# EAGLE design master-board plus slave (EAGLE 9.2.0)
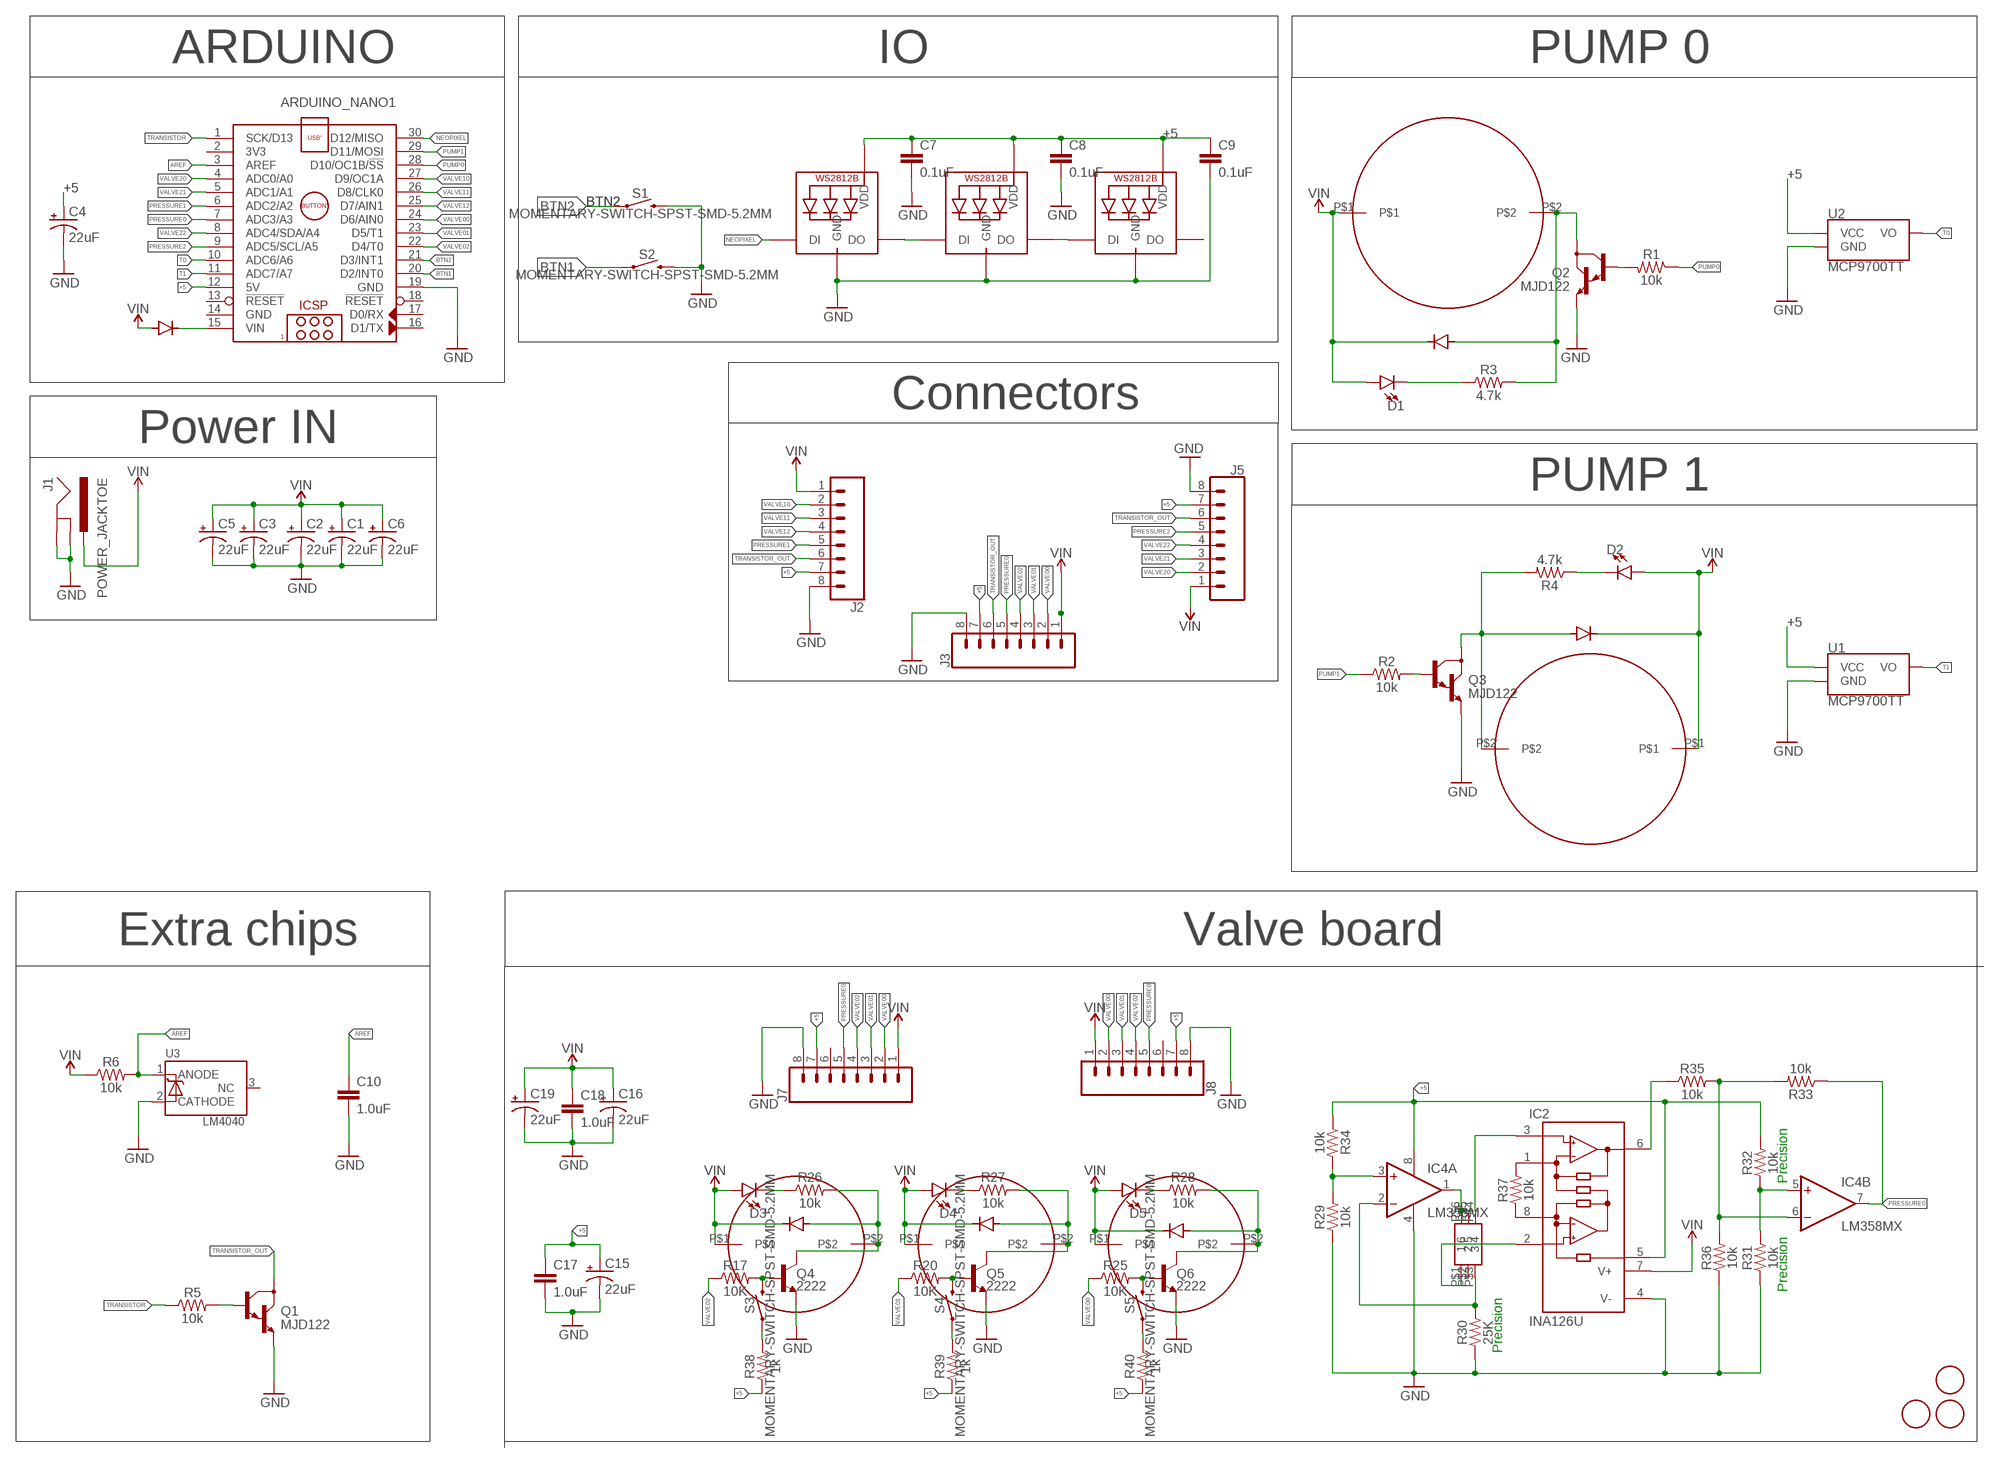
[diagram p0: schematic, sheet 1]

## Parts
ARDUINO_NANO1  ARDUINO_NANO  [ARDUINO_NANO]
C1  22uF  22UF-POLAR-PANASONIC_C-35V-20%  [PANASONIC_C]
C2  22uF  22UF-POLAR-PANASONIC_C-35V-20%  [PANASONIC_C]
C3  22uF  22UF-POLAR-PANASONIC_C-35V-20%  [PANASONIC_C]
C4  22uF  22UF-POLAR-PANASONIC_C-35V-20%  [PANASONIC_C]
C5  22uF  22UF-POLAR-PANASONIC_C-35V-20%  [PANASONIC_C]
C6  22uF  22UF-POLAR-PANASONIC_C-35V-20%  [PANASONIC_C]
C7  0.1uF  0.1UF-0603-25V-(+80/-20%)  [0603]
C8  0.1uF  0.1UF-0603-25V-(+80/-20%)  [0603]
C9  0.1uF  0.1UF-0603-25V-(+80/-20%)  [0603]
C10  1.0uF  1.0UF-0603-16V-10%  [0603]
C15  22uF  22UF-POLAR-PANASONIC_C-35V-20%  [PANASONIC_C]
C16  22uF  22UF-POLAR-PANASONIC_C-35V-20%  [PANASONIC_C]
C17  1.0uF  1.0UF-0603-16V-10%  [0603]
C18  1.0uF  1.0UF-0603-16V-10%  [0603]
C19  22uF  22UF-POLAR-PANASONIC_C-35V-20%  [PANASONIC_C]
D1  LED0603  [LED-0603]
D2  LED0603  [LED-0603]
D3  LED0603  [LED-0603]
D4  LED0603  [LED-0603]
D5  LED0603  [LED-0603]
IC2  INA126U  [SO08]
IC4  LM358MX  [SO08]
J1  POWER_JACKTOE  [POWER_JACK_SMD_OVERPASTE_TOE]
J2  CONN_08FLIPPED  [1X08]
J3  CONN_08"  [1X08]
J5  CONN_081X08_FEMALE_FLIPPED  [1X08_FEMALE_FLIPPED]
J7  CONN_08  [1X08_MALE_FLIPPED]
J8  CONN_08NO_SILK_FEMALE_PTH  [1X08_NO_SILK]
LED1  WS2812B5050  [WS2812B]
LED2  WS2812B5050  [WS2812B]
LED3  WS2812B5050  [WS2812B]
Q1  MJD122  [DPAK]
Q2  MJD122  [DPAK]
Q3  MJD122  [DPAK]
Q4  2222  TRANS_NPN-MMBT2222AL  [SOT23-3]
Q5  2222  TRANS_NPN-MMBT2222AL  [SOT23-3]
Q6  2222  TRANS_NPN-MMBT2222AL  [SOT23-3]
R1  10k  10KOHM-0603-1/10W-1%  [0603]
R2  10k  10KOHM-0603-1/10W-1%  [0603]
R3  4.7k  4.7KOHM-0603-1/10W-1%  [0603]
R4  4.7k  4.7KOHM-0603-1/10W-1%  [0603]
R5  10k  10KOHM-0603-1/10W-1%  [0603]
R6  10k  10KOHM-0603-1/10W-1%  [0603]
R17  10K  1KOHM-0603-1/10W-1%  [0603]
R20  10K  1KOHM-0603-1/10W-1%  [0603]
R25  10K  1KOHM-0603-1/10W-1%  [0603]
R26  10k  10KOHM-0603-1/10W-1%  [0603]
R27  10k  10KOHM-0603-1/10W-1%  [0603]
R28  10k  10KOHM-0603-1/10W-1%  [0603]
R29  10k  10KOHM-0603-1/10W-1%  [0603]
R30  25K  10KOHM-0603-1/10W-1%  [0603]
R31  10k  10KOHM-0603-1/10W-1%  [0603]
R32  10k  10KOHM-0603-1/10W-1%  [0603]
R33  10k  10KOHM-0603-1/10W-1%  [0603]
R34  10k  10KOHM-0603-1/10W-1%  [0603]
R35  10k  10KOHM-0603-1/10W-1%  [0603]
R36  10k  10KOHM-0603-1/10W-1%  [0603]
R37  10k  10KOHM-0603-1/10W-1%  [0603]
R38  1k  1KOHM-0603-1/10W-1%  [0603]
R39  1k  1KOHM-0603-1/10W-1%  [0603]
R40  1k  1KOHM-0603-1/10W-1%  [0603]
S1  MOMENTARY-SWITCH-SPST-SMD-5.2MM  [TACTILE_SWITCH_SMD_5.2MM]
S2  MOMENTARY-SWITCH-SPST-SMD-5.2MM  [TACTILE_SWITCH_SMD_5.2MM]
S3  MOMENTARY-SWITCH-SPST-SMD-5.2MM  [TACTILE_SWITCH_SMD_5.2MM]
S4  MOMENTARY-SWITCH-SPST-SMD-5.2MM  [TACTILE_SWITCH_SMD_5.2MM]
S5  MOMENTARY-SWITCH-SPST-SMD-5.2MM  [TACTILE_SWITCH_SMD_5.2MM]
U1  MCP9700TT  [SOT23-3]
U2  MCP9700TT  [SOT23-3]
U3  LM4040  [SOT23-3]
U$1  AIYIMA-PUMP-A5F083  [A5F083]
U$2  AIYIMA-PUMP-A5F083  [A5F083]
U$3  IN4148  [SOD123]
U$4  IN4148  [SOD123]
U$7  IN4148  [SOD123]
U$10  FIDUCIAL  [FIDUCIAL_1MM]
U$11  FIDUCIAL  [FIDUCIAL_1MM]
U$12  FIDUCIAL  [FIDUCIAL_1MM]
U$17  CJV23-SOLENOID-VALVE  [CJV23]
U$18  CJV23-SOLENOID-VALVE  [CJV23]
U$19  CJV23-SOLENOID-VALVE  [CJV23]
U$20  IN4148  [SOD123]
U$21  IN4148  [SOD123]
U$22  IN4148  [SOD123]
U$23  2SMPP-03  [2SMPP-03]

## Nets
+5: ARDUINO_NANO1.12(5V) C4.+ C7.1 C8.1 C9.1 C15.+ C17.1 IC2.5(REF) IC4.8(P:V+) J2.7 J3.7 J5.7 J7.7 J8.7 LED1.1-VDD(VDD) LED2.1-VDD(VDD) LED3.1-VDD(VDD) R32.2 R34.1 R38.1 R39.1 R40.1 U1.1(VCC) U2.1(VCC)
AREF: ARDUINO_NANO1.3(AREF) C10.1 R6.2 U3.1(ANODE)
BTN1: ARDUINO_NANO1.20(D2/INT0) S2.1
BTN2: ARDUINO_NANO1.21(D3/INT1) S1.1
GND: ARDUINO_NANO1.19(GND) C1.- C2.- C3.- C4.- C5.- C6.- C7.2 C8.2 C9.2 C10.2 C15.- C16.- C17.2 C18.2 C19.- IC2.4(V-) IC4.4(P:V-) J1.GND(GNDBREAK) J1.P$4(GND) J2.8 J3.8 J5.8 J7.8 J8.8 LED1.3-GND(GND) LED2.3-GND(GND) LED3.3-GND(GND) Q1.3(E) Q2.3(E) Q3.3(E) Q4.2(E) Q5.2(E) Q6.2(E) R29.1 R30.1 R31.1 R36.1 S1.3 S2.3 U1.3(GND) U2.3(GND) U3.2(CATHODE)
N$1: ARDUINO_NANO1.15(VIN) U$7.C
N$2: Q3.1(B) R2.2
N$3: Q2.1(B) R1.2
N$5: Q2.4(C) R3.2 U$1.P$2 U$3.A
N$6: Q3.4(C) R4.2 U$2.P$2 U$4.A
N$7: Q1.1(B) R5.2
N$12: D1.C R3.1
N$17: D2.C R4.1
N$21: LED2.2-DOUT(DO) LED3.4-DIN(DI)
N$26: LED1.2-DOUT(DO) LED2.4-DIN(DI)
N$54: Q4.1(B) R17.2 S3.3
N$55: Q5.1(B) R20.2 S4.3
N$56: Q6.1(B) R25.2 S5.3
N$57: Q6.3(C) R28.2 U$19.P$2 U$22.A
N$58: Q5.3(C) R27.2 U$18.P$2 U$21.A
N$59: Q4.3(C) R26.2 U$17.P$2 U$20.A
N$65: D5.C R28.1
N$66: D4.C R27.1
N$67: D3.C R26.1
N$68: IC2.2(-IN) U$23.P$1
N$69: IC4.1(A:OUT) U$23.P$5 U$23.P$6
N$70: IC2.3(+IN) U$23.P$4
N$71: IC4.3(A:+IN) R29.2 R34.2
N$72: IC2.8(RG) R37.1
N$73: IC2.1(RG) R37.2
N$74: IC4.6(B:-IN) R33.2 R35.2 R36.2
N$75: IC4.5(B:+IN) R31.2 R32.1
N$76: IC4.2(A:-IN) R30.2 U$23.P$3
N$77: IC2.6(OUT) R35.1
N$78: R38.2 S3.1
N$79: R39.2 S4.1
N$80: R40.2 S5.1
NEOPIXEL: ARDUINO_NANO1.30(D12/MISO) LED1.4-DIN(DI)
PRESSURE0: ARDUINO_NANO1.7(ADC3/A3) IC4.7(B:OUT) J3.5 J7.5 J8.5 R33.1
PRESSURE1: ARDUINO_NANO1.6(ADC2/A2) J2.5
PRESSURE2: ARDUINO_NANO1.9(ADC5/SCL/A5) J5.5
PUMP0: ARDUINO_NANO1.28(D10/OC1B/!SS) R1.1
PUMP1: ARDUINO_NANO1.29(D11/MOSI) R2.1
T0: ARDUINO_NANO1.10(ADC6/A6) U2.2(VO)
T1: ARDUINO_NANO1.11(ADC7/A7) U1.2(VO)
TRANSISTOR: ARDUINO_NANO1.1(SCK/D13) R5.1
TRANSISTOR_OUT: J2.6 J3.6 J5.6 Q1.4(C)
VALVE00: ARDUINO_NANO1.24(D6/AIN0) J3.2 J7.2 J8.2 R25.1
VALVE01: ARDUINO_NANO1.23(D5/T1) J3.3 J7.3 J8.3 R20.1
VALVE02: ARDUINO_NANO1.22(D4/T0) J3.4 J7.4 J8.4 R17.1
VALVE10: ARDUINO_NANO1.27(D9/OC1A) J2.2
VALVE11: ARDUINO_NANO1.26(D8/CLK0) J2.3
VALVE12: ARDUINO_NANO1.25(D7/AIN1) J2.4
VALVE20: ARDUINO_NANO1.4(ADC0/A0) J5.2
VALVE21: ARDUINO_NANO1.5(ADC1/A1) J5.3
VALVE22: ARDUINO_NANO1.8(ADC4/SDA/A4) J5.4
VIN: C1.+ C2.+ C3.+ C5.+ C6.+ C16.+ C18.1 C19.+ D1.A D2.A D3.A D4.A D5.A IC2.7(V+) J1.VIN0(PWR) J2.1 J3.1 J5.1 J7.1 J8.1 R6.1 U$1.P$1 U$2.P$1 U$3.C U$4.C U$7.A U$17.P$1 U$18.P$1 U$19.P$1 U$20.C U$21.C U$22.C
Unconnected: ARDUINO_NANO1.2(3V3) ARDUINO_NANO1.13(!RESET) ARDUINO_NANO1.16(D1/TX) ARDUINO_NANO1.17(D0/RX) ARDUINO_NANO1.18(!RESET) J7.6 J8.6 LED3.2-DOUT(DO) U3.3(NC) U$23.P$2

## Notes on the sheet
- ARDUINO | IO | PUMP 0
- Connectors
- Power IN
- PUMP 1
- Extra chips | Valve board
- Precision
- Precision
- Precision

## Power pins joined to a net without a drawn wire
GND: ARDUINO_NANO1.14(GND)

## Library data of the parts
ARDUINO_NANO1 = master-board plus slave:ARDUINO_NANO: Arduino Nano V3.0 Module Overview: The Arduino Nano is a small, complete, and breadboard-friendly board based on the ATmega328 (Arduino Nano 3.x) or ATmega168 (Arduino Nano 2.x). It has more or less the same functionality of the Arduino Duemilanove, but in a different package. It lacks only a DC power jack, and works with a Mini-B USB cable instead of a standard one. The Nano was designed and is being produced by Gravitech <http://www.gravitech.us/arna30wiatp.html>. General specifications: Item Value Microcontroller Atmel ATmega168 or ATmega328 Operating Voltage (logic level) 5 V Input Voltage (recommended) 7-12 V Input Voltage (limits) 6-20 V Digital I/O Pins 14 (of which 6 provide PWM output) Analog Input Pins 8 DC Current per I/O Pin 40 mA Flash Memory 16 KB (ATmega168) or 32 KB (ATmega328) of which 2 KB used by bootloader SRAM 1 KB (ATmega168) or 2 KB (ATmega328) EEPROM 512 bytes (ATmega168) or 1 KB (ATmega328) Clock Speed 16 MHz Dimensions (Inches) 0.73" x 1.70" Dimensions (mm) 18mm x 45mm Overall height About 9 mm (not including pins) Weigth 5 g Power: The Arduino Nano can be powered via the Mini-B USB connection, 6-20V unregulated external power supply (pin 30), or 5V regulated external power supply (pin 27). The power source is automatically selected to the highest voltage source. Memory: The ATmega168 has 16 KB of flash memory for storing code (of which 2 KB is used for the bootloader); the ATmega328 has 32 KB, (also with 2 KB used for the bootloader). The ATmega168 has 1 KB of SRAM and 512 bytes of EEPROM (which can be read and written with the EEPROM library); the ATmega328 has 2 KB of SRAM and 1 KB of EEPROM. Input and Output: Each of the 14 digital pins on the Nano can be used as an input or output, using pinMode(), digitalWrite(), and digitalRead() functions. They operate at 5 volts. Each pin can provide or receive a maximum of 40 mA and has an internal pull-up resistor (disconnected by default) of 20-50 kOhms. In addition, some pins have specialized functions. Visit Arduino - ArduinoBoardNano <https://www.arduino.cc/en/Main/ArduinoBoardNano>
C1-C6 C15 C16 C19 = master-board plus slave:22UF-POLAR: 22µF polarized capacitors A capacitor is a passive two-terminal electrical component used to store electrical energy temporarily in an electric field.; PROD_ID: CAP-08618
C7-C9 = master-board plus slave:0.1UF: 0.1µF ceramic capacitors A capacitor is a passive two-terminal electrical component used to store electrical energy temporarily in an electric field.; PROD_ID: CAP-00810
C10 C17 C18 = master-board plus slave:1.0UF: 1µF ceramic capacitors A capacitor is a passive two-terminal electrical component used to store electrical energy temporarily in an electric field.; PROD_ID: CAP-00868
D1-D5 = master-board plus slave:LED: LED (Generic) Standard schematic elements and footprints for 5mm, 3mm, 1206, and 0603 sized LEDs. Generic LEDs with no color specified.
IC2 = master-board plus slave:INA126: Instrumentation Amplifier Micropower, Single and Dual Versions; AVAILABILITY: Unavailable; DESCRIPTION: the ina126 and ina2126 are precision instrumentation amplifiers for accurate low noise differential signal acquisitio...; MF: Texas Instruments; MP: INA126; PACKAGE: TSSOP-8 Texas Instruments; PRICE: None
IC4 = master-board plus slave:LM358: OP AMP also LM158; LM258; LM2904 Source: http://cache.national.com/ds/LM/LM158.pdf
J1 = master-board plus slave:POWER_JACK: Power Jack Connector This is the standard 5.5mm barrel jack for power. The PTH is the most common, proven, reliable, footprint. The Slot footprint only works if the mill layer is transmitted to the PCB fab house so be warned. Here are the connectors we sell at SparkFun: DC Barrel Power Jack/Connector <https://www.sparkfun.com/products/119> (PRT-00119) DC Barrel Power Jack/Connector (SMD) <https://www.sparkfun.com/products/12748> (PRT-12748) DC Barrel Jack Adapter - Breadboard Compatible <https://www.sparkfun.com/products/10811> (PRT-10811) It is used on this SparkFun product (and many, many others): SparkFun RedBoard - Programmed with Arduino <https://www.sparkfun.com/products/12757> (DEV-12757) Also, if you need a mating power supply or connector, please check these out: Wall Adapter Power Supply - 9VDC 650mA <https://www.sparkfun.com/products/298> (TOL-00298) DC Barrel Jack Adapter - Male <https://www.sparkfun.com/products/10287> (PRT-10287); PROD_ID: CONN-08106; SF_ID: PRT-12748
J2 J5 J7 = master-board plus slave:CONN_08: Multi connection point. Often used as Generic Header-pin footprint for 0.1 inch spaced/style header connections On any of the 0.1 inch spaced packages, you can populate with these: Break Away Headers - Straight <https://www.sparkfun.com/products/116> (PRT-00116) Break Away Male Headers - Right Angle <https://www.sparkfun.com/products/553> (PRT-00553) Female Headers <https://www.sparkfun.com/products/115> (PRT-00115) Break Away Headers - Machine Pin <https://www.sparkfun.com/products/117> (PRT-00117) Break Away Female Headers - Swiss Machine Pin <https://www.sparkfun.com/products/743> (PRT-00743) Arduino Stackable Header - 8 Pin <https://www.sparkfun.com/products/9279> (PRT-09279) For SCREWTERMINALS and SPRING TERMINALS visit here: Screw Terimnals on SparkFun.com <https://www.sparkfun.com/search/results?term=Screw+Terminals> (5mm/3.5mm/2.54mm spacing) This device is also useful as a general connection point to wire up your design to another part of your project. Our various solder wires solder well into these plated through hole pads. Hook-Up Wire - Assortment (Stranded, 22 AWG) <https://www.sparkfun.com/products/11375> (PRT-11375) Hook-Up Wire - Assortment (Solid Core, 22 AWG) <https://www.sparkfun.com/products/11367> (PRT-11367) View the entire wire category on our website here <https://www.sparkfun.com/categories/141> Special notes: Molex polarized connector foot print use with SKU : PRT-08231 with associated crimp pins and housings. 1MM SMD Version SKU: PRT-10208 NOTES ON THE VARIANTS LOCK and LOCK_LONGPADS... This footprint was designed to help hold the alignment of a through-hole component (i.e. 6-pin header) while soldering it into place. You may notice that each hole has been shifted either up or down by 0.005 of an inch from it's more standard position (which is a perfectly straight line). This slight alteration caused the pins (the squares in the middle) to touch the edges of the holes. Because they are alternating, it causes a "brace" to hold the component in place. 0.005 has proven to be the perfect amount of "off-center" position when using our standard breakaway headers. Although looks a little odd when you look at the bare footprint, once you have a header in there, the alteration is very hard to notice. Also,if you push a header all the way into place, it is covered up entirely on the bottom side.
J3 J8 = master-board plus slave:CONN_08: Multi connection point. Often used as Generic Header-pin footprint for 0.1 inch spaced/style header connections On any of the 0.1 inch spaced packages, you can populate with these: Break Away Headers - Straight <https://www.sparkfun.com/products/116> (PRT-00116) Break Away Male Headers - Right Angle <https://www.sparkfun.com/products/553> (PRT-00553) Female Headers <https://www.sparkfun.com/products/115> (PRT-00115) Break Away Headers - Machine Pin <https://www.sparkfun.com/products/117> (PRT-00117) Break Away Female Headers - Swiss Machine Pin <https://www.sparkfun.com/products/743> (PRT-00743) Arduino Stackable Header - 8 Pin <https://www.sparkfun.com/products/9279> (PRT-09279) For SCREWTERMINALS and SPRING TERMINALS visit here: Screw Terimnals on SparkFun.com <https://www.sparkfun.com/search/results?term=Screw+Terminals> (5mm/3.5mm/2.54mm spacing) This device is also useful as a general connection point to wire up your design to another part of your project. Our various solder wires solder well into these plated through hole pads. Hook-Up Wire - Assortment (Stranded, 22 AWG) <https://www.sparkfun.com/products/11375> (PRT-11375) Hook-Up Wire - Assortment (Solid Core, 22 AWG) <https://www.sparkfun.com/products/11367> (PRT-11367) View the entire wire category on our website here <https://www.sparkfun.com/categories/141> Special notes: Molex polarized connector foot print use with SKU : PRT-08231 with associated crimp pins and housings. 1MM SMD Version SKU: PRT-10208 NOTES ON THE VARIANTS LOCK and LOCK_LONGPADS... This footprint was designed to help hold the alignment of a through-hole component (i.e. 6-pin header) while soldering it into place. You may notice that each hole has been shifted either up or down by 0.005 of an inch from it's more standard position (which is a perfectly straight line). This slight alteration caused the pins (the squares in the middle) to touch the edges of the holes. Because they are alternating, it causes a "brace" to hold the component in place. 0.005 has proven to be the perfect amount of "off-center" position when using our standard breakaway headers. Although looks a little odd when you look at the bare footprint, once you have a header in there, the alteration is very hard to notice. Also,if you push a header all the way into place, it is covered up entirely on the bottom side.; PROD_ID: CONN-08438
LED1-LED3 = master-board plus slave:WS2812B
Q1-Q3 = MJD122:MJD122: TRANS DARL NPN 100V 5A DPAK; AVAILABILITY: Unavailable; MF: STMicroelectronics; MP: MJD122; PACKAGE: None; PRICE: None
Q4-Q6 = master-board plus slave:TRANS_NPN: NPN transistor Current controlled devices typically used to amplify current or used as a switch. BC547 - COM-08928 <http://www.sparkfun.com/products/8928> (TO-92 45V 100mA) (1.Collector 2.Base 3.Emitter) 2N3904 - COM-00521 <http://www.sparkfun.com/products/521> (TO-92 40V 200mA) (1.Emitter 2.Base 3.Collector) P2N2222A - COM-12852 <http://www.sparkfun.com/products/12852> (TO-92 40V 600mA) (1.Collector 2.Base 3.Emitter); PROD_ID: TRANS-08049; VALUE: 600mA/40V
R1 R2 R5 R6 R26-R29 R31-R37 = master-board plus slave:10KOHM: 10kΩ resistor A resistor is a passive two-terminal electrical component that implements electrical resistance as a circuit element. Resistors act to reduce current flow, and, at the same time, act to lower voltage levels within circuits. - Wikipedia; PROD_ID: RES-00824
R3 R4 = master-board plus slave:4.7KOHM: 4.7kΩ resistor A resistor is a passive two-terminal electrical component that implements electrical resistance as a circuit element. Resistors act to reduce current flow, and, at the same time, act to lower voltage levels within circuits. - Wikipedia; PROD_ID: RES-07857
R17 R20 R25 = master-board plus slave:1KOHM: 1kΩ resistor A resistor is a passive two-terminal electrical component that implements electrical resistance as a circuit element. Resistors act to reduce current flow, and, at the same time, act to lower voltage levels within circuits. - Wikipedia; PROD_ID: RES-07856; VALUE: 1k
R30 = master-board plus slave:10KOHM: 10kΩ resistor A resistor is a passive two-terminal electrical component that implements electrical resistance as a circuit element. Resistors act to reduce current flow, and, at the same time, act to lower voltage levels within circuits. - Wikipedia; PROD_ID: RES-00824; VALUE: 10k
R38-R40 = master-board plus slave:1KOHM: 1kΩ resistor A resistor is a passive two-terminal electrical component that implements electrical resistance as a circuit element. Resistors act to reduce current flow, and, at the same time, act to lower voltage levels within circuits. - Wikipedia; PROD_ID: RES-07856
S1-S5 = master-board plus slave:MOMENTARY-SWITCH-SPST: Momentary Switch (Pushbutton) - SPST Normally-open (NO) SPST momentary switches (buttons, pushbuttons). Variants PTH-12MM - 12mm square, through-hole Momentary Pushbutton Switch - 12mm Square <https://www.sparkfun.com/products/9190> (COM-09190) PTH-6.0MM, PTH-6.0MM-KIT - 6.0mm square, through-hole Mini Pushbutton Switch <https://www.sparkfun.com/products/97> (COM-00097) KIT package intended for soldering kit's - only one side of pads' copper is exposed. PTH-RIGHT-ANGLE-KIT - Right-angle, through-hole Right Angle Tactile Button <https://www.sparkfun.com/products/10791> - Used on SparkFun BigTime Watch Kit <https://www.sparkfun.com/products/11734> SMD-12MM - 12mm square, surface-mount Tactile Button - SMD (12mm) <https://www.sparkfun.com/products/12993> (COM-12993) Used on SparkFun PicoBoard <https://www.sparkfun.com/products/11888> SMD-4.5MM - 4.5mm Square Trackball Switch Used on SparkFun Blackberry Trackballer Breakout <https://www.sparkfun.com/products/13169> SMD-4.6MMX2.8MM - 4.60mm x 2.80mm, surface mount Used on SparkFun SAMD21 Mini Breakout <https://www.sparkfun.com/products/13664> SMD-5.2MM, SMD-5.2-REDUNDANT - 5.2mm square, surface-mount Mini Pushbutton Switch - SMD <https://www.sparkfun.com/products/8720> (COM-08720) Used on Arduino Pro Mini <https://www.sparkfun.com/products/11114> REDUNDANT package connects both switch circuits together SMD-6.0X3.5MM - 6.0 x 3.5mm, surface mount Momentary Reset Switch SMD <https://www.sparkfun.com/products/8229> (COM-08229) SMD-6.2MM-TALL - 6.2mm square, surface mount Tactile Button - SMD (6mm) <https://www.sparkfun.com/products/12992> Used on SparkFun Digital Sandbox <https://www.sparkfun.com/products/12651> SMD-RIGHT-ANGLE - Right-angle, surface mount Used on SparkFun Block for Intel® Edison - Arduino <https://www.sparkfun.com/products/13036>; PROD_ID: SWCH-08247; SF_SKU: COM-08720
U1 U2 = SparkFun-Sensors:MCP9700: Microchip MCP9700 Analog-Output Temperature Sensor The MCP9700 can accurately measure temperature from -40C to +150C. The output of the MCP9700 is calibrated to a slope of 10mV/°C and has a DC offset of 500mV. The offset allows reading negative temperatures without the need for a negative supply. Datasheet <http://ww1.microchip.com/downloads/en/DeviceDoc/20001942F.pdf> SparkFun Products LilyPad Temperature Sensor <https://www.sparkfun.com/products/8777> (DEV-08777) SparkFun Digital Sandbox <https://www.sparkfun.com/products/12651> (DEV-12651); PROD_ID: IC-08917
U3 = LM4040:LM4040; AVAILABILITY: Unavailable; DESCRIPTION: lm4040 improved precision micropower shunt voltage reference with multiple reverse breakdown voltages; MF: Amphenol; MP: LM4040; PACKAGE: None; PRICE: None
U$1 U$2 = master-board plus slave:AIYIMA-PUMP-A5F083: Aiyima company vacuum/high pressure air pump. 12V, 0.35A, 3LPM
U$3 U$4 U$7 U$20-U$22 = master-board plus slave:IN4148
U$10-U$12 = master-board plus slave:FIDUCIAL: For use by pick and place machines to calibrate the vision/machine, 1mm By microbuilder.eu
U$17-U$19 = master-board plus slave:CJV23-SOLENOID-VALVE: CJV23 solenoid valve
U$23 = master-board plus slave:2SMPP-03

## Board
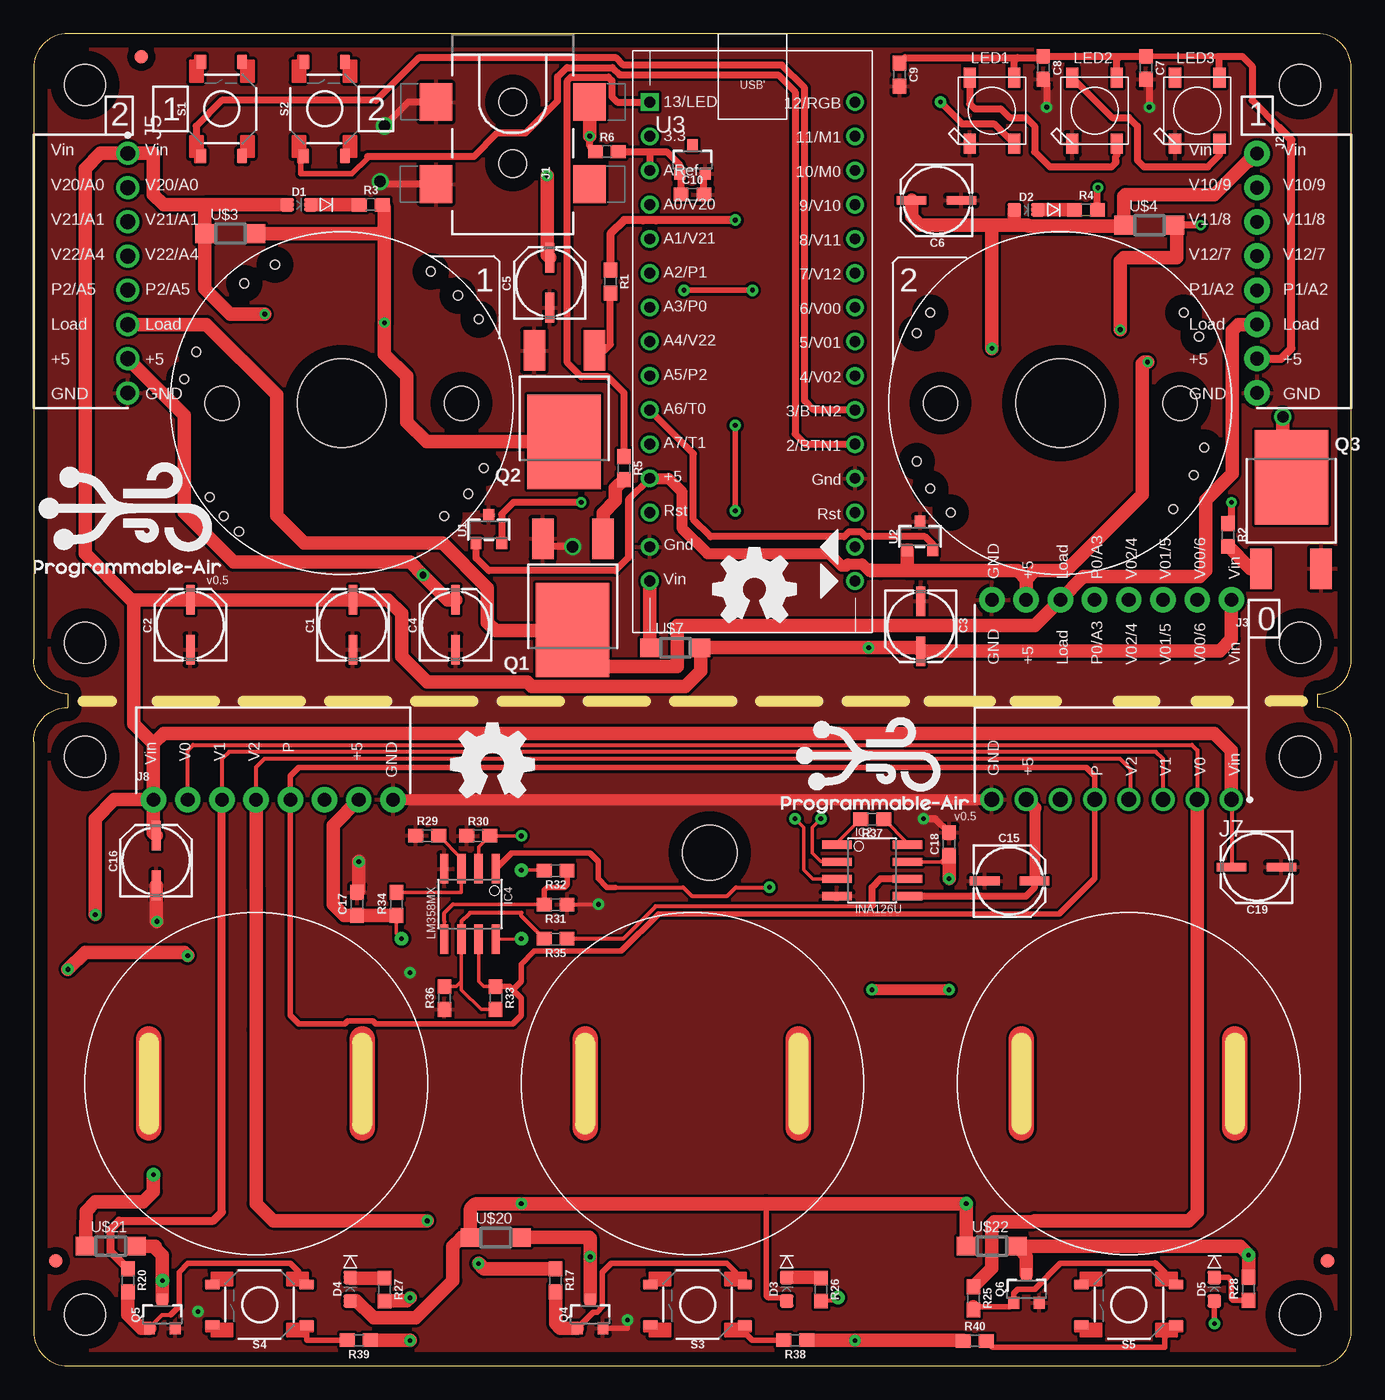
[diagram p1: board, top side]
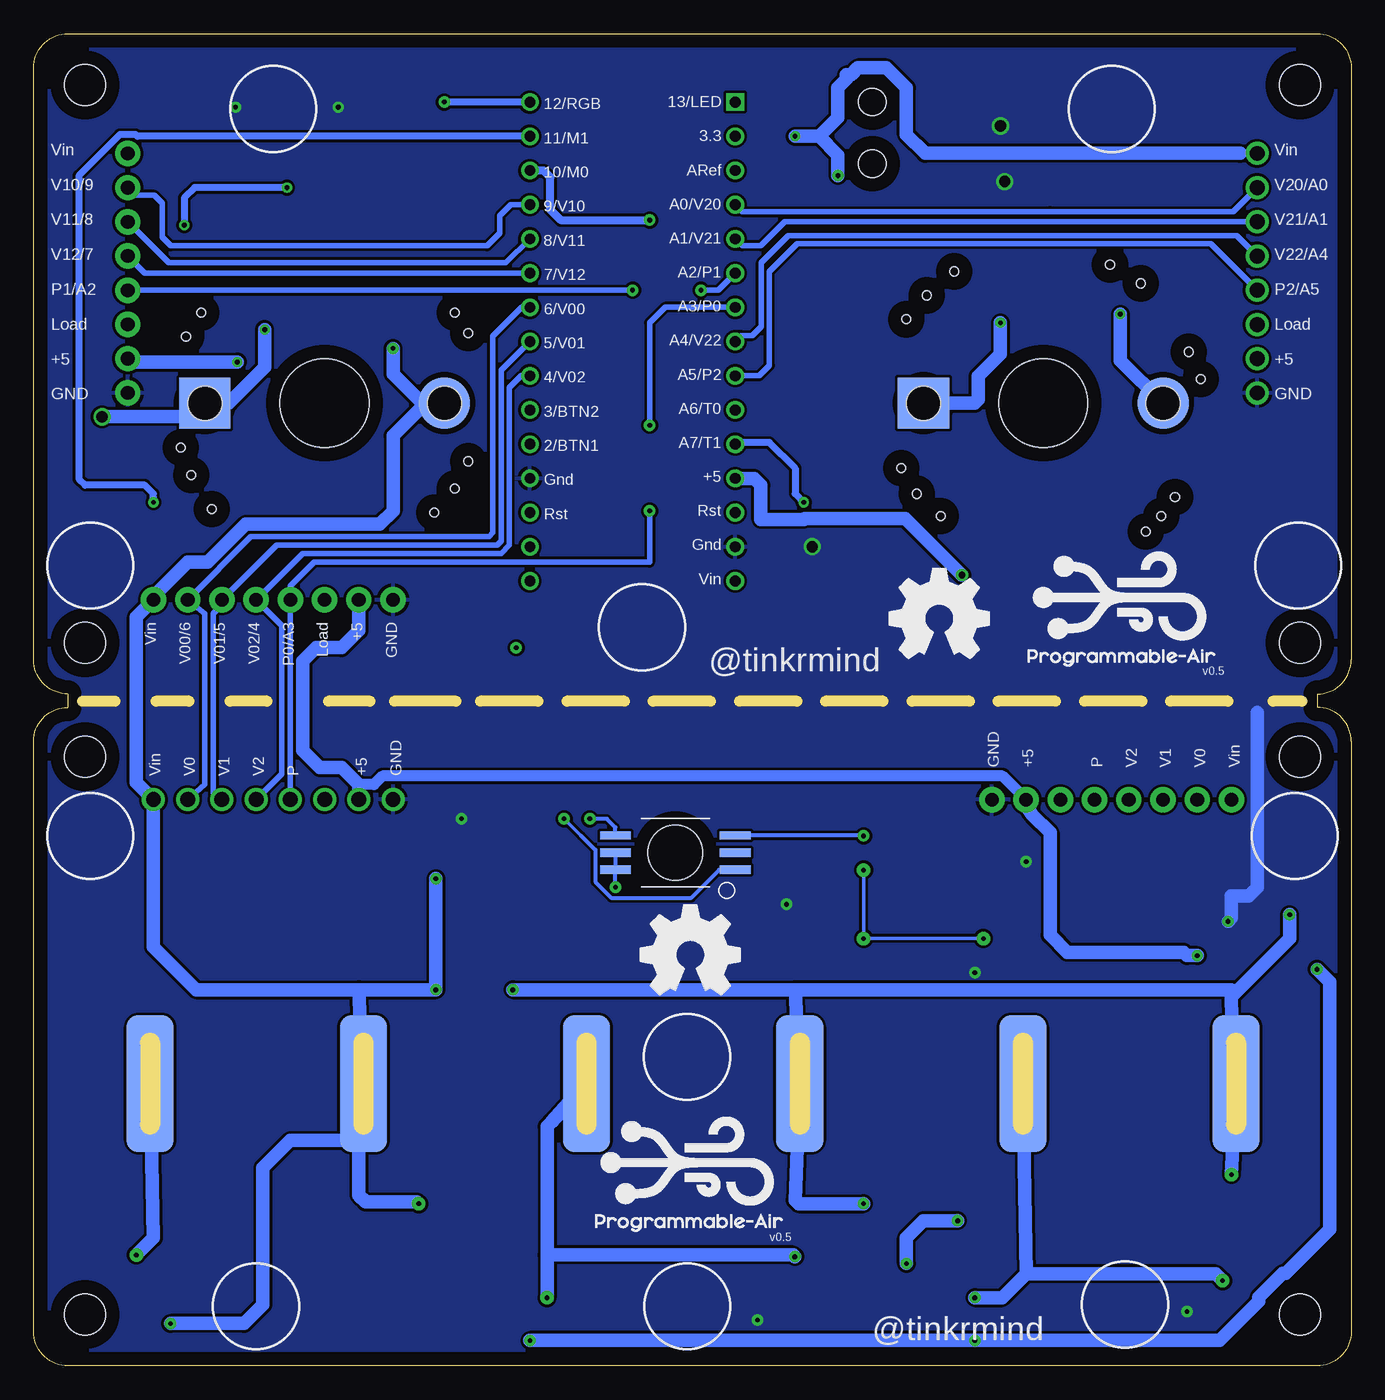
[diagram p2: board, bottom side, seen from below]

Size 97.79 x 98.91 mm. Coordinates in mm from the lower left corner, seen from the top.
Outline: 2.54,49.89 arc-90 0,52.43 0,96.37 arc-90 2.54,98.91 95.25,98.91 arc-90 97.79,96.37 97.79,52.43 arc-90 95.25,49.89 95.25,48.89 arc-90 97.79,46.35 97.79,2.54 arc-90 95.25,0 2.54,0 arc-90 0,2.54 0,46.35 arc-90 2.54,48.89 2.54,49.89
Copper layers (1*16): Top 0.035mm / dielectric 1.5mm / Bottom 0.035mm
Design rules "default *": minimum track width 8mil, minimum drill 0.35mm, track to track 8mil, track to pad 8mil, pad to pad 8mil, via to via 8mil, smd to smd 8mil, copper to edge 40mil, drill to drill 6mil, minimum pad ring 10mil, minimum via ring 8mil, stop-mask expansion 4mil, vias tented up to drill 33mil, thermal gap 10mil
Holes 3.05 mm at 3.81,95.1 3.81,53.7 93.98,53.7 93.98,95.1 3.81,3.81 3.81,45.21 93.98,45.21 93.98,3.81
Holes 0.65 mm at 13.08,64.49 14.1,63.09 15.24,61.95 30.48,63.09 32.26,64.74 33.4,66.65 29.46,81.25 31.5,79.48 33.02,77.7 15.62,80.37 17.91,81.76 11.18,73.25 12.06,75.29 65.53,76.68 66.55,78.21 65.53,67.16 66.55,65.13 68.07,63.35 84.58,63.6 86.11,66.14 86.87,68.17 85.34,78.21 86.49,76.43
tKeepout: area 91.4,92.6 to 97.8,98.9; area 91.4,49.9 to 97.8,56.2; area 0,92.6 to 6.3,98.9; area 0,49.9 to 6.3,56.2; area 10.2,58.8 to 35.6,84.2; area 63.5,58.8 to 88.9,84.2; area 36.2,8.3 to 61.6,33.7; area 36.2,8.3 to 61.6,33.7; area 3.8,8.3 to 29.2,33.7; area 68.6,8.3 to 94,33.7; area 0,42.7 to 6.3,48.9; area 91.4,42.7 to 97.8,48.9; 2 more areas
bKeepout: area 0,49.9 to 6.3,56.2; area 0,92.6 to 6.3,98.9; area 91.4,92.6 to 97.8,98.9; area 91.4,49.9 to 97.8,56.2; area 0,42.7 to 6.3,48.9; area 91.4,42.7 to 97.8,48.9; area 91.4,0 to 97.8,6.3; area 0,0 to 6.3,6.3
Milling: 15 lines

### Footprints (pad centres in the part's own frame; a part is rotated, then mirrored left to right if it is on the bottom)
ARDUINO_NANO = drill 0.8 square: 1 -20.32,-7.62 | drill 0.8: 2 -17.78,-7.62; 3 -15.24,-7.62; 4 -12.7,-7.62; 5 -10.16,-7.62; 6 -7.62,-7.62; 7 -5.08,-7.62; 8 -2.54,-7.62; 9 0,-7.62; 10 2.54,-7.62; 11 5.08,-7.62; 12 7.62,-7.62; 13 10.16,-7.62; 14 12.7,-7.62; 15 15.24,-7.62; 16 15.24,7.62; 17 12.7,7.62; 18 10.16,7.62; 19 7.62,7.62; 20 5.08,7.62; 21 2.54,7.62; 22 0,7.62; 23 -2.54,7.62; 24 -5.08,7.62; 25 -7.62,7.62; 26 -10.16,7.62; 27 -12.7,7.62; 28 -15.24,7.62; 29 -17.78,7.62; 30 -20.32,7.62
PANASONIC_C = smd 2.2 x 0.65: + 1.9,-0.2; - -1.8,-0.2
0603 = smd 1.1 x 1: 1 -0.85,0; 2 0.85,0
LED-0603 = smd 1 x 1: A -0.877,0; C 0.877,0
SO08 = smd 0.61 x 2.21: 1 -1.905,-2.616; 2 -0.635,-2.616; 3 0.635,-2.616; 4 1.905,-2.616; 5 1.905,2.616; 6 0.635,2.616; 7 -0.635,2.616; 8 -1.905,2.616
POWER_JACK_SMD_OVERPASTE_TOE = smd 2.8 x 2.4: GND 0,-5.7; P$4 6.1,-5.7; VIN0 0,5.7; VIN1 6.1,5.7 | hole 2.032: 0,0; 4.572,0
1X08 = drill 1.016 pad 1.88: 1 0,0; 2 2.54,0; 3 5.08,0; 4 7.62,0; 5 10.16,0; 6 12.7,0; 7 15.24,0; 8 17.78,0
1X08_FEMALE_FLIPPED = drill 1.105 pad 1.705: 1 0,0; 2 2.54,0; 3 5.08,0; 4 7.62,0; 5 10.16,0; 6 12.7,0; 7 15.24,0; 8 17.78,0
1X08_MALE_FLIPPED = drill 1.105 pad 1.705: 1 0,0; 2 2.54,0; 3 5.08,0; 4 7.62,0; 5 10.16,0; 6 12.7,0; 7 15.24,0; 8 17.78,0
1X08_NO_SILK = drill 1.016 pad 1.88: 1 0,0; 2 2.54,0; 3 5.08,0; 4 7.62,0; 5 10.16,0; 6 12.7,0; 7 15.24,0; 8 17.78,0
WS2812B = smd 1.5 x 0.9: 1-VDD 2.45,-1.65; 2-DOUT 2.45,1.65; 3-GND -2.45,1.65; 4-DIN -2.45,-1.65
DPAK = smd 1.6 x 2.997: 1 -2.261,-4.928; 3 2.21,-4.928 | smd 5.452 x 7: 4 0,1.853
SOT23-3 = smd 0.8 x 0.9: 1 -0.95,-1; 2 0.95,-1; 3 0,1.1
TACTILE_SWITCH_SMD_5.2MM = smd 1 x 0.7: 1 -3.513,1.562; 2 3.5,1.5; 3 -3.5,-1.5; 4 3.5,-1.5
A5F083 = smd 3.81 x 3.81 bottom: P$1 -8.89,0; P$2 8.89,0 | hole 6.604: 0,0 | hole 2.54: -8.89,0; 8.89,0
SOD123 = smd 1.4 x 1.4: A 1.9,0; C -1.9,0
FIDUCIAL_1MM = smd 1 x 1: 1 0,0
CJV23 = smd 3.5 x 10.16 bottom: P$1 -7.966,0; P$2 7.866,0
2SMPP-03 = smd 2.286 x 0.61 bottom: P$1 4.445,1.27; P$2 4.445,0; P$3 4.445,-1.27; P$4 -4.445,-1.27; P$5 -4.445,0; P$6 -4.445,1.27 | hole 4.064: 0,0

### Placement (x,y rotation side)
ARDUINO_NANO1  53.34,73.51 270 top
C1  23.5,54.97 90 top
C2  11.43,54.97 90 top
C3  66.04,54.97 270 top
C4  31.11,54.97 90 top
C5  38.1,80.37 90 top
C6  67.06,86.33 180 top
C7  82.55,96.37 270 top
C8  74.93,96.37 270 top
C9  64.26,95.86 270 top
C10  48.9,86.97 0 top
C15  72.39,36.2 0 top
C16  8.89,37.47 90 top
C17  24,34.29 90 top
C18  67.94,38.73 90 top
C19  90.81,36.83 180 top
D1  19.68,86.21 0 top
D2  73.66,85.83 0 top
D3  55.88,5.69 90 top
D4  23.5,5.69 90 top
D5  87.63,5.69 90 top
IC2  62.23,36.78 270 top
IC4  32.38,34.29 180 top
J1  35.56,93.83 270 top
J2  90.81,90.02 270 top
J3  88.9,56.87 180 top
J5  6.99,90.02 270 top
J7  88.9,42.04 180 top
J8  8.89,42.04 0 top
LED1  71.12,93.19 90 top
LED2  78.74,93.19 90 top
LED3  86.36,93.19 90 top
Q1  40.01,56.49 180 top
Q2  39.37,70.46 180 top
Q3  93.34,64.11 0 top
Q4  41.3,3.78 0 top
Q5  9.55,3.78 0 top
Q6  73.69,5.69 0 top
R1  42.8,80.49 270 top
R2  88.65,61.7 270 top
R3  25.02,86.21 0 top
R4  78.11,85.83 0 top
R5  43.81,66.65 270 top
R6  42.55,90.14 0 top
R17  38.73,6.35 270 top
R20  6.99,6.35 270 top
R25  69.74,5.02 270 top
R26  58.42,5.66 270 top
R27  26.04,5.66 270 top
R28  90.17,5.71 90 top
R29  29.21,39.37 0 top
R30  32.99,39.34 0 top
R31  38.73,34.24 180 top
R32  38.73,36.78 180 top
R33  34.29,27.3 270 top
R34  26.92,34.29 90 top
R35  38.73,31.7 180 top
R36  30.48,27.3 90 top
R37  62.23,40.59 180 top
R38  56.52,1.9 180 top
R39  24.13,1.9 180 top
R40  69.85,1.85 0 top
S1  13.97,93.32 90 top
S2  21.59,93.32 90 top
S3  49.28,4.55 180 top
S4  16.76,4.55 180 top
S5  81.28,4.55 180 top
U1  33.78,62.08 0 top
U2  65.79,61.57 0 top
U3  48.9,89.51 0 top
U$1  22.86,71.48 0 top
U$2  76.2,71.48 0 top
U$3  14.61,84.05 0 top
U$4  82.8,84.68 0 top
U$7  47.62,53.31 0 top
U$10  7.99,97.19 0 top
U$11  1.65,7.78 0 top
U$12  96.03,7.78 0 top
U$17  48.9,20.95 0 top
U$18  16.51,20.95 0 top
U$19  81.28,20.95 0 top
U$20  34.29,9.53 0 top
U$21  5.71,8.89 0 top
U$22  71.12,8.89 0 top
U$23  50.16,38.1 180 top

### Tracks (layer width: path | path; a pad name or v marks a point on that pad's centre or on a via)
+5  (via drill 0.35, 0.35 pad 0.85, 0.35 pad 1, 0.5)
  Top 0.254: IC4.8 36.16,31.69 v36.2,31.72 | v36.2,36.8 37.86,36.8 R32.2 | R34.1 26.92,32.11 v27.3,31.72
  Top 0.406: 89.7,97.22 C7.1 | 62.87,59.03 61.98,59.03
  Top 0.508: 80.64,97.22 C8.1 74.84,97.13 73.03,97.13 | 80.64,97.22 C7.1 | 80.64,97.22 80.39,96.96 LED2.1-VDD | LED1.1-VDD 72.77,96.87 73.03,97.13 | C9.1 64.68,97.13 73.03,97.13 | 92.46,91.92 90.42,93.95 90.42,96.49 89.7,97.22 87.88,97.22 88.01,97.09 LED3.1-VDD | ARDUINO_NANO1.12 44.15,64.31 44.15,59.99 43.18,59.03 33.78,59.03 32.83,59.97 U1.1 | IC2.5 73.66,34.87 73.66,34.9 74.29,35.53 C15.+ | R38.1 57.39,1.88 | R40.1 68.97,1.88
  Top 0.61: J2.7 92.58,74.78 93.34,75.54 93.34,91.03 92.46,91.92
  Top 0.813: 74.29,41.41 C15.+ | ARDUINO_NANO1.12 47.12,65.89 48.11,64.9 48.11,62.2 50.01,60.3 59.05,60.3 59.98,59.38 60.28,59.38 60.44,59.53 61.48,59.53 61.98,59.03
  Top 1.016: R39.1 27.91,1.9 v27.94,1.88 | 57.39,1.88 v60.96,1.88 68.97,1.88 | v2.54,29.44 3.81,30.71 11.18,30.71 v11.43,30.45 | J5.7 11.18,70.59 11.18,63.33 14.85,59.66 27.94,59.66 v28.89,58.71 30.74,56.87 C4.+ | 73.66,58.39 73.03,59.03 64.84,59.03 | 73.66,58.39 J3.7 | U2.1 64.84,59.03 | J7.7 74.29,41.41 | R34.1 C17.1 23.05,33.44 22.23,34.26 22.23,40.13 J8.7 | 73.66,58.39 74.3,59.03 76.64,59.03 82.3,64.69 82.3,74.4 82.42,74.52 v82.68,74.52 | 62.06,59.1 62.13,59.03 62.87,59.03 64.84,59.03
  Bottom 0.254: v36.2,36.8 v36.2,31.72 v27.3,31.72
  Bottom 0.813: J8.7 25.88,43.79 71.91,43.79 72.54,43.15 73.66,43.15
  Bottom 1.016: J7.7 73.66,43.15 74.93,44.42 76.56,44.42 77.83,45.69 77.83,52.32 76.83,53.31 74.93,53.31 73.66,54.58 J3.7 | v60.96,1.88 v27.94,1.88 9.78,1.88 6.86,4.8 6.86,5.07 5.07,6.86 4.88,6.86 1.6,10.13 1.6,28.5 v2.54,29.44 | v11.43,30.45 12.19,30.45 12.45,30.71 21.08,30.71 22.35,31.98 22.35,39.6 23.66,40.91 arc45 J8.7 | v28.89,58.71 33.1,62.92 40.56,62.92 40.64,62.84 43.81,62.84 43.81,65.38 44.32,65.89 ARDUINO_NANO1.12 | J2.7 90.55,74.52 v82.68,74.52
AREF
  Top 0.508: R6.2 45.72,90.14 | 45.72,90.14 46.99,90.14 47.95,89.19 U3.1 48.05,88.41 C10.1 | 45.72,90.14 ARDUINO_NANO1.3
BTN1
  Top 0.406: S2.1 19.81,89.59 19.81,88.49 23.62,88.49 24.79,89.67 24.79,89.81
  Top 0.508: ARDUINO_NANO1.20 57.28,68.43 56.52,69.19 56.52,94.59 55.24,95.86 43.48,95.86 42.94,96.4 39.58,96.4 38.89,95.71 38.89,93.93 36.51,91.54 34.42,91.54 32.68,89.81 24.79,89.81
BTN2
  Top 0.406: S1.1 12.41,90.44 12.06,90.78
  Top 0.508: ARDUINO_NANO1.21 57.91,70.97 57.23,71.65 57.23,94.88 55.54,96.57 43.77,96.57 43.24,97.11 28.57,97.11 25.42,93.95 13.97,93.95 12.06,92.05 12.06,90.78
GND  (via drill 0.35 pad 0.85, 0.85)
  Top 0.305: R31.1 41.88,34.24 v41.91,34.26
  Top 0.406: Q4.2 44.07,2.78 v44.07,3.4
  Top 0.508: C18.2 66.92,40.61 v66.04,40.61 | C8.2 75.18,95.26 v75.18,93.45 | C7.2 82.8,95.26 v82.8,93.45 | C10.2 49.74,88.41 U3.2 | v40.01,60.82 38.39,60.82 Q1.3 | J1.GND 27.81,93.83 v26.04,92.05 | J1.P$4 25.72,87.73 v25.72,87.92
  Top 0.813: J8.8 J7.8
  Top 1.016: C17.2 24.13,35.27 v24.13,37.44 | v9.14,32.99 9.09,33.05 C16.-
  Bottom 1.016: 6.99,48.52 6.99,35.53 7.62,34.9 8.89,34.9 8.89,33.25 v9.14,32.99
  other vias: 12.19,4.04 27.94,29.18
  pour Top: -1.27,-1.3 99.06,-1.3 99.06,100.3 -1.27,100.3
  pour Bottom: -2.54,-2.57 100.33,-2.57 100.33,100.3 69.85,100.3 -2.54,100.3
N$1
  Top 1.016: U$7.C ARDUINO_NANO1.15
N$2
  Top 1.016: Q3.1 90.31,59.18 R2.2
N$3
  Top 0.508: Q2.1 42.35,75.39 42.8,75.83 R1.2
N$5  (via drill 0.35)
  Top 1.016: R3.2 26.04,86.04 26.04,83.79 | 26.04,83.79 v26.04,77.44 26.04,75.13 27.69,73.47 27.69,70.08 29.16,68.61 Q2.4 | U$3.A 25.78,84.05 26.04,83.79
  Bottom 1.016: v26.04,77.44 26.04,75.13 27.69,73.47 27.69,71.73 27.94,71.48 U$1.P$2
N$6  (via drill 0.35, 0.85)
  Top 0.508: 84.7,84.82 U$4.A v86.61,84.68 | R4.2 78.95,87.44 v78.99,87.48
  Top 1.016: v92.71,70.46 92.71,66.6 Q3.4 | 84.7,84.82 84.84,84.68 84.84,82.27 80.9,82.27 80.64,82.02 v80.64,76.94
  Bottom 0.508: v78.99,87.48 85.85,87.48 86.61,86.72 v86.61,84.68
  Bottom 1.016: v80.64,76.94 80.64,74.14 83.31,71.48 U$2.P$2 86.11,70.46 v92.71,70.46
N$7
  Top 1.016: Q1.1 42.27,63.32 43.18,64.24 43.18,65.16 R5.2
N$12
  Top 1.016: D1.C R3.1
N$17
  Top 1.016: R4.1 D2.C
N$21
  Top 0.508: LED2.2-DOUT 80.05,92.68 81.28,92.68 81.92,92.05 81.92,89.51 82.41,89.02 87.14,89.02 88.01,89.89 LED3.4-DIN
N$26
  Top 0.508: LED2.4-DIN 80.39,89.89 80.33,89.83 80.33,89.51 80.33,89.34 80.01,89.02 75.42,89.02 74.3,90.14 74.3,92.05 73.66,92.68 72.43,92.68 71.79,93.32 69.85,93.32 69.47,93.7 LED1.2-DOUT
N$54
  Top 0.406: Q4.1 41.54,3.97 41.81,3.97 42.22,4.37 42.22,6.96 42.85,7.59 51.44,7.59 52.78,6.25 S3.3
  Top 1.016: Q4.1 39.1,2.78 38.73,3.15 R17.2
N$55
  Top 0.305: Q5.1 8.6,2.86 9.53,3.78 10.16,3.78
  Top 0.406: 10.16,3.78 10.79,4.42 10.79,6.96 11.43,7.59 19.05,7.59 19.66,6.98 19.66,6.65 S4.3
  Top 1.016: Q5.1 7.99,2.78 6.99,3.78 R20.2
N$56
  Top 0.406: 69.74,4.4 72.45,4.4 Q6.1 72.73,5.4 73.03,5.69 74.3,5.69 76.2,7.59 83.23,7.59
  Top 0.508: S5.3 83.23,7.59
  Top 1.016: 69.74,4.4 R25.2
N$57  (via drill 0.35 pad 1)
  Top 1.016: Q6.3 73.69,8.1 U$22.A 73.03,8.86 89.53,8.86 v90.17,8.23 R28.2
  Bottom 1.016: v90.17,8.23 88.9,9.5 U$19.P$2
N$58  (via drill 0.35 pad 0.85, 0.35 pad 1)
  Top 1.016: Q5.3 v9.55,6.32 9.55,8.2 8.91,8.84 9.03,8.89 U$21.A | v27.94,5.05 27.7,4.81 R27.2
  Bottom 1.016: v27.94,5.05 25.91,5.05 24.13,6.83 | v9.55,6.32 10.06,6.83 24.13,6.83 | U$18.P$2 24.13,6.83
N$59  (via drill 0.35 pad 0.85, 0.35 pad 1)
  Top 0.305: v59.69,5.05 59.45,4.81 R26.2
  Top 1.016: Q4.3 v41.3,8.1 41.3,9.47 41.25,9.52 U$20.A
  Bottom 0.305: U$17.P$2 59.38,18.08 59.69,17.78
  Bottom 1.016: U$17.P$2 59.38,18.08 59.69,17.78 59.69,8.23 | 59.69,8.23 v59.69,5.05 | v41.3,8.1 41.43,8.23 59.69,8.23
N$65
  Top 0.406: D5.C 88.66,6.57 88.9,6.32 88.9,5.05 arc90 89.09,4.86 R28.1
N$66
  Top 0.406: D4.C arc90 23.55,6.51
  Top 1.016: R27.1 23.55,6.51 D4.C
N$67
  Top 1.016: D3.C 58.29,6.57 arc-45 R26.1
N$68  (via drill 0.35 pad 0.85)
  Top 0.254: IC2.2 59.59,37.44 58.42,37.44 57.78,38.07 57.78,39.98 v58.42,40.61
  Bottom 0.254: v58.42,40.61 57.15,39.34
  Bottom 0.305: 57.15,39.34 56.11,38.3 56.11,35.93 54.93,34.75 48.98,34.75 46.91,36.83 U$23.P$1
N$69  (via drill 0.35 pad 0.85)
  Top 0.305: v54.61,35.53 52.13,35.53 51.49,34.9 48.84,34.9 48.2,35.53 43.18,35.53
  Top 0.406: IC4.1 35.48,38.07 41.27,38.07 41.91,37.44 41.91,36.17 42.55,35.53 43.18,35.53
  Bottom 0.305: v54.61,35.53 U$23.P$6 U$23.P$5
N$70  (via drill 0.35 pad 0.85)
  Top 0.254: v56.52,40.61 57.15,39.98 57.15,36.8 57.81,36.14 IC2.3
  Bottom 0.305: v56.52,40.61 55.24,40.61 54.61,39.98 U$23.P$4
N$71
  Top 0.254: R29.2 31.75,37.68 IC4.3 31.75,35.14 R34.2
N$72
  Top 0.254: R37.1 64.85,38.82 IC2.8
N$73
  Top 0.254: R37.2 59.61,38.82 IC2.1
N$74
  Top 0.254: IC4.6 31.75,28.55 | 31.75,28.55 31.36,28.15 R36.2 | R33.2 33.21,26.45 31.75,27.91 31.75,28.55
  Top 0.305: IC4.6 31.75,32.99 32.38,33.63 35.56,33.63 36.2,33.63 36.2,33.39 36.39,33.19 R35.2
N$75
  Top 0.254: IC4.5 30.48,32.99 | 31.11,34.26 37.86,34.26 R31.2
  Top 0.305: 30.48,32.99 30.48,33.63 31.11,34.26
  Top 0.406: R32.1 39.59,35.75 39.37,35.53 38.1,35.53 37.88,35.32 R31.2
N$76  (via drill 0.35 pad 0.85)
  Top 0.254: IC4.2 33.02,38.52 R30.2 v36.2,39.34
  Bottom 0.254: 36.22,39.37 v36.2,39.34
  Bottom 0.305: v36.2,39.34 arc-90 36.22,39.37 U$23.P$3
N$77
  Top 0.305: R35.1 43.74,31.7 46.16,34.11 61.59,34.11 | 61.59,34.11 62.17,34.11 62.28,34.22 | 61.59,34.11
  Top 0.508: 62.28,34.22 62.23,34.26 62.23,35.53 62.87,36.17 64.82,36.17 IC2.6
N$78
  Top 0.406: R38.2 53.34,1.9 52.97,2.27 52.79,2.46 S3.1
N$79
  Top 0.406: R39.2 20.3,1.9 20.28,1.92 S4.1
N$80
  Top 0.406: 70.8,1.75 R40.2 71.18,1.37 83.95,1.37 83.95,2.14 S5.1
NEOPIXEL  (via drill 0.35 pad 0.85)
  Top 0.508: LED1.4-DIN 71.29,92.22 68.92,92.22 v67.31,93.83
  Bottom 0.508: ARDUINO_NANO1.30 v67.31,93.83
PRESSURE0  (via drill 0.35 pad 0.85)
  Top 0.254: IC4.7 33.02,28.55 33.41,28.15 R33.1
  Top 0.406: v52.07,69.82 v52.07,63.47 | R33.1 35.32,28.15 35.56,27.91 | 35.56,27.91 36.2,27.28 36.2,26.01 35.56,25.37 25.4,25.37 25.16,25.62 23.31,25.62 23.07,25.37 19.68,25.37 19.05,26.01 J8.5 19.05,43.79 19.68,44.42 78.11,44.42 78.74,43.79 J7.5 78.74,36.17 76.12,33.55 46.39,33.55 43.63,30.79 37.17,30.79 36.2,29.82 36.2,28.55 35.56,27.91
  Bottom 0.406: ARDUINO_NANO1.7 50.93,78.59 52.07,77.44 v52.07,69.82 | v52.07,63.47 52.07,59.66 76.96,59.66 78.74,57.89 J3.5 J7.5
PRESSURE1  (via drill 0.35 pad 0.85)
  Top 0.406: v48.26,79.86 v53.34,79.86
  Bottom 0.406: ARDUINO_NANO1.6 46.99,79.86 v48.26,79.86 | J2.5 v53.34,79.86
PRESSURE2
  Bottom 0.406: J5.5 10.44,83.31 41.12,83.31 43.18,81.25 43.18,74.27 43.94,73.51 ARDUINO_NANO1.9
PUMP0  (via drill 0.35 pad 0.85)
  Top 0.61: R1.1 42.8,84.05 43.81,85.06 45.22,85.06 45.24,85.05 46.2,85.05 46.22,85.06 v52.07,85.06
  Bottom 0.61: v52.07,85.06 58.67,85.06 59.44,85.83 59.44,88.24 59.94,88.75 ARDUINO_NANO1.28
PUMP1  (via drill 0.35)
  Top 0.508: v88.9,64.11 88.9,62.8 arc-90 R2.1
  Bottom 0.508: ARDUINO_NANO1.29 90.1,91.29 90.23,91.41 91.38,91.41 94.44,88.36 94.44,65.84 93.98,65.38 89.53,65.38 88.9,64.74 88.9,64.47 v88.9,64.11
T0
  Top 0.508: ARDUINO_NANO1.10 48.97,67.72 48.97,62.84 50.24,61.57 60.15,61.57 60.5,61.92 61.42,61.92 61.77,61.57 66.17,61.57 66.74,61 U2.2
T1  (via drill 0.35)
  Top 0.508: v40.64,64.11 35.61,64.11 34.73,63.23 U1.2
  Bottom 0.508: v40.64,64.11 41.27,64.74 41.27,66.65 43.18,68.55 45.59,68.55 ARDUINO_NANO1.11
TRANSISTOR
  Top 0.508: R5.1 43.81,72.24 42.62,73.43 40.64,73.43 39.6,74.47 39.6,95.42 39.87,95.68 42.65,95.68 42.92,95.42 42.92,94.22 43.31,93.83 ARDUINO_NANO1.1
TRANSISTOR_OUT
  Top 1.016: J5.6 12.82,77.32 18.03,72.11 18.03,63.13 20.07,61.09 30.35,61.09 33.68,57.76 33.68,55.19 34.29,54.58 39.95,54.58 Q1.4 40.01,51.9 47.77,51.9 47.77,54.95 74.28,54.95 J3.6 77.92,58.59 86.55,58.59 87,59.03 87,64.29 88.95,66.25 88.95,76.86 89.41,77.32 J2.6
VALVE00
  Top 0.305: J8.2 11.43,45.69 11.84,46.1 85.95,46.1 86.36,45.69 J7.2
  Top 1.016: R25.1 71.09,7.22 71.09,10.5 71.28,10.69 74.21,10.69 74.28,10.77 85.72,10.77 86.36,11.4 J7.2
  Bottom 0.406: ARDUINO_NANO1.24 61.57,78.59 63.7,76.45 63.7,61.85 63.98,61.57 81.66,61.57 J3.2 85.09,55.85 85.09,43.15 J7.2
VALVE01
  Top 0.305: J7.3 83.82,45.06 83.29,45.59 14.5,45.59 13.97,45.06 13.97,42.52 J8.3
  Top 0.406: 13.97,11.4 J8.3
  Top 0.61: R20.1 5.71,8.47 5.71,10.13 6.35,10.77 13.34,10.77 13.97,11.4 13.97,42.52
  Bottom 0.406: J7.3 83.82,41.88 84.45,42.52 84.45,55.85 83.82,56.49 J3.3 79.76,60.93 63.4,60.93 63.09,61.24 63.09,73.91 ARDUINO_NANO1.23
VALVE02  (via drill 0.35 pad 0.85)
  Top 0.305: J8.4 16.51,44.45 17.14,45.08 80.62,45.08 81.43,44.27 81.43,41.88
  Top 1.016: v33.02,7.59 33.41,7.2 R17.1 | v29.21,10.77 17.78,10.77 16.51,12.04 16.51,24.97 16.51,35.53 J8.4 | J7.4 81.43,41.88
  Bottom 0.406: ARDUINO_NANO1.22 61.59,73.51 62.48,72.62 62.48,60.93 63.09,60.32 77.83,60.32 J3.4 79.38,54.97 79.38,43.94 J7.4
  Bottom 1.016: v33.02,7.59 33.02,9.5 31.75,10.77 v29.21,10.77
VALVE10
  Bottom 0.406: J2.2 90.23,86.91 88.84,86.91 88.27,86.33 88.27,83.79 87.63,83.16 64.14,83.16 63.19,84.1 63.19,85.39 62.38,86.21 ARDUINO_NANO1.27
VALVE11
  Bottom 0.406: ARDUINO_NANO1.26 62.74,81.89 87.76,81.89 J2.3
VALVE12
  Bottom 0.406: ARDUINO_NANO1.25 89.53,81.13 J2.4
VALVE20
  Bottom 0.305: 7.24,87.22 J5.2
  Bottom 0.406: ARDUINO_NANO1.4 45.21,85.7 22.35,85.7 8.76,85.7 7.24,87.22
VALVE21
  Bottom 0.406: J5.3 42.04,84.94 43.81,83.16 45.21,83.16 ARDUINO_NANO1.5
VALVE22
  Bottom 0.305: 7.05,82.46 J5.4
  Bottom 0.406: ARDUINO_NANO1.8 45.28,76.49 44.45,76.49 43.79,77.15 43.79,81.91 41.79,83.92 8.51,83.92 7.05,82.46
VIN  (via drill 0.35, 0.35 pad 0.85, 0.35 pad 1)
  Top 0.254: 67.47,37.41 IC2.7
  Top 0.305: J7.1 C19.+
  Top 0.406: C18.1 67.47,37.41 | D5.A v87.63,3.15 | D3.A arc90 55.64,5.05 54.61,5.05 arc-90 54.36,5.31 54.36,12.04
  Top 0.508: 41.26,93.45 J1.VIN0 | 90.55,89.76 J2.1 | R6.1 41.27,90.56 v41.27,91.29
  Top 0.61: 90.23,89.45 90.55,89.76
  Top 0.813: v67.94,27.91 v62.23,27.91
  Top 1.016: C18.1 v67.94,36.17 | J7.1 88.9,45.69 87.63,46.96 9.65,46.96 8.89,46.2 | J3.1 88.9,53.95 88.02,53.07 C3.+ 65.59,53.31 v61.98,53.31 U$7.A 49.52,51.6 48.35,50.43 36.98,50.43 36.64,50.77 29.21,50.77 27.3,52.68 27.3,55.85 26.29,56.87 C1.+ C2.+ 7.24,56.87 | v38.1,88.37 38.1,82.47 C5.+ | J2.1 90.23,89.45 90.11,89.45 87.63,86.97 81.03,86.97 80.9,86.85 U$4.C 80.83,84.61 73.84,84.61 73.77,84.67 72.78,84.67 | v41.27,91.29 41.27,93.43 41.26,93.45 | J8.1 8.89,46.2 | 8.89,46.2 7.44,47.65 7.44,56.67 7.24,56.87 | v4.57,33.5 4.57,40.61 5.99,42.04 J8.1 | U$21.C 3.89,11.48 4.57,12.17 8.13,12.17 8.89,12.93 v8.89,14.2 | J8.1 8.89,39.56 C16.+ | D2.A 72.78,84.67 | 12.7,86.21 9.65,86.21 8.89,86.97 8.89,90.02 J5.1 4.95,90.02 3.81,88.87 3.81,60.3 7.24,56.87 | 12.7,86.21 12.71,86.2 U$3.C 12.71,79.98 14.61,78.08 v17.14,78.08 | C6.+ 65.16,85.31 65.8,84.67 71.12,84.67 | 71.12,84.67 72.78,84.67 | D4.A 23.93,4.81 23.95,4.84 25.24,3.55 28.34,3.55 31.11,6.32 31.11,8.86 31.73,9.47 arc-90 31.77,9.52 U$20.C 32.39,11.41 arc-90 33.02,12.04 v36.2,12.04 54.36,12.04 v69.22,12.04 v69.22,12.03 U$22.C | v71.12,75.54 71.12,84.67 | D1.A 12.7,86.21
  Bottom 0.406: 88.9,56.49 J3.1
  Bottom 0.508: J5.1 8.26,90.02
  Bottom 1.016: 41.27,27.91 U$17.P$1 41.27,12.29 41.02,12.04 v36.2,12.04 | 73.66,27.91 v67.94,27.91 v67.94,36.17 | v62.23,27.91 41.27,27.91 | U$19.P$1 73.66,27.91 | 41.27,27.91 8.89,27.91 8.89,27.41 | 8.89,27.41 8.89,26.9 U$18.P$1 v8.89,14.2 | 73.66,27.91 85.72,27.91 88.9,31.09 J7.1 90.17,43.31 90.17,55.6 J3.1 | 8.26,90.02 31.62,90.02 33.02,91.41 33.02,94.88 34.51,96.37 36.61,96.37 37.12,95.86 37.47,95.86 37.47,95.51 38.1,94.88 38.1,92.68 39.5,91.29 | v41.27,91.29 39.5,91.29 | 39.5,91.29 38.1,89.89 v38.1,88.37 | 8.89,27.41 4.57,31.72 v4.57,33.5 | v69.22,12.04 69.34,12.17 73.15,12.17 73.66,12.67 73.66,16.74 U$19.P$1 | U$19.P$1 73.66,17.75 74.68,16.74 78.74,16.74 80.77,14.71 80.77,4.55 82.17,3.15 v87.63,3.15 | 88.9,56.49 88.9,57.12 86.36,59.66 84.86,59.66 82.04,62.48 72.11,62.48 71.12,63.47 71.12,69.06 68.71,71.48 U$2.P$1 68.96,71.48 71.12,73.63 v71.12,75.54 | v17.14,78.08 17.14,74.65 U$1.P$1

### Text on the board
tPlace: 2 | 1 | 2 | 1 | 1 | 2 | Vin / / V20/A0 / / V21/A1 / / V22/A4 / / P2/A5 / / Load / / +5 / / GND | Vin / / V20/A0 / / V21/A1 / / V22/A4 / / P2/A5 / / Load / / +5 / / GND | Vin / / V10/9 / / V11/8 / / V12/7 / / P1/A2 / / Load / / +5 / / GND | Vin / / V10/9 / / V11/8 / / V12/7 / / P1/A2 / / Load / / +5 / / GND | v0.5 | GND / / +5 / / Load / / P0/A3 / / V02/4 / / V01/5 / / V00/6 / / Vin | 0 | GND / / +5 / / Load / / P0/A3 / / V02/4 / / V01/5 / / V00/6 / / Vin | Vin / / V0 / / V1 / / V2 / / P / / / / +5 / / GND | GND / / +5 / / / / P / / V2 / / V1 / / V0 / / Vin | v0.5
bPlace: Vin / / V20/A0 / / V21/A1 / / V22/A4 / / P2/A5 / / Load / / +5 / / GND | Vin / / V10/9 / / V11/8 / / V12/7 / / P1/A2 / / Load / / +5 / / GND | Vin / / V00/6 / / V01/5 / / V02/4 / / P0/A3 / / Load / / +5 / / GND | @tinkrmind | v0.5 | GND / / +5 / / / / P / / V2 / / V1 / / V0 / / Vin | Vin / / V0 / / V1 / / V2 / / P / / / / +5 / / GND | v0.5 | @tinkrmind